# Altium schematic sheet Boost-converter-output.SchDoc
size A4; SheetNumber: 4; SheetTotal: 4
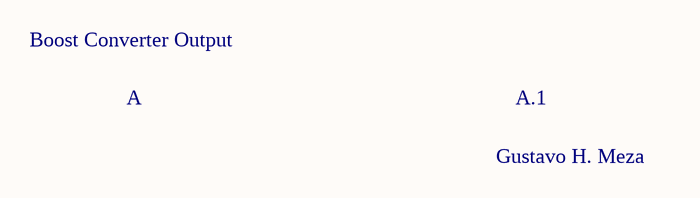
[diagram p0: Boost-converter-output.SchDoc]

## Notes on the sheet
- Boost Converter Output
- A
- A.1
- Gustavo H. Meza